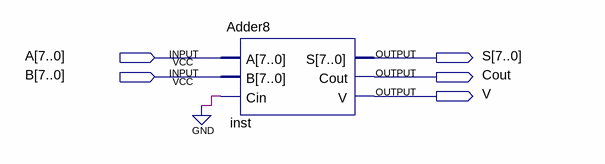
[diagram p0: schematic sheet]
// Quartus schematic Adder8S.bdf as structural Verilog: 1 symbols, 5 pins
module Adder8S (
  input  [7:0] A,
  input  [7:0] B,
  output [7:0] S,
  output Cout,
  output V
);

  Adder8 inst (.A(A), .B(B), .Cin(1'b0), .S(S), .Cout(Cout), .V(V));
endmodule
